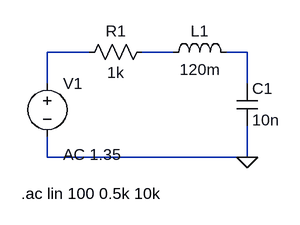
[diagram p0: schematic RLC-Resonance.asc]
RLC-Resonance.asc, the LTspice schematic file:
Version 4.1
SHEET 1 880 680
WIRE 128 64 64 64
WIRE 256 64 208 64
WIRE 368 64 336 64
WIRE 64 112 64 64
WIRE 368 112 368 64
WIRE 64 224 64 192
WIRE 368 224 368 176
WIRE 368 224 64 224
FLAG 368 224 0
SYMBOL voltage 64 96 R0
WINDOW 123 24 124 Left 2
WINDOW 39 0 0 Left 0
SYMATTR InstName V1
SYMATTR Value ""
SYMATTR Value2 AC 1.35
SYMBOL res 224 48 R90
WINDOW 0 0 56 VBottom 2
WINDOW 3 32 56 VTop 2
SYMATTR InstName R1
SYMATTR Value 1k
SYMBOL ind 240 80 R270
WINDOW 0 32 56 VTop 2
WINDOW 3 5 56 VBottom 2
SYMATTR InstName L1
SYMATTR Value 120m
SYMBOL cap 352 112 R0
SYMATTR InstName C1
SYMATTR Value 10n
TEXT 24 280 Left 2 !.ac lin 100 0.5k 10k

The netlist it stands for:
* RLC-Resonance.asc
V1 N001 0 AC 1.35
R1 N002 N001 1k
L1 N002 N003 120m
C1 N003 0 10n
.ac lin 100 0.5k 10k
.backanno
.end